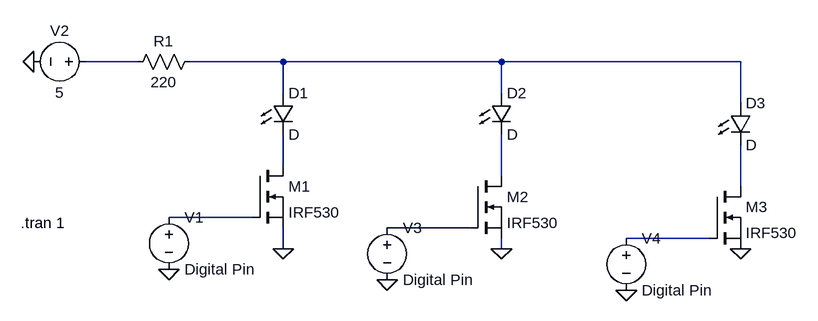
[diagram p0: schematic Sensor_test.asc]
Sensor_test.asc, the LTspice schematic file:
Version 4
SHEET 1 1172 680
WIRE 16 64 -64 64
WIRE 240 64 96 64
WIRE 576 64 240 64
WIRE 944 64 576 64
WIRE 240 112 240 64
WIRE 576 112 576 64
WIRE 944 128 944 64
WIRE 240 224 240 176
WIRE 576 240 576 176
WIRE 944 256 944 192
WIRE 192 304 64 304
WIRE 528 320 400 320
WIRE 896 336 768 336
WIRE 240 352 240 320
WIRE 576 352 576 336
FLAG -144 64 0
FLAG 64 384 0
FLAG 400 400 0
FLAG 576 352 0
FLAG 768 416 0
FLAG 944 352 0
FLAG 240 352 0
SYMBOL nmos 192 224 R0
SYMATTR InstName M1
SYMATTR Value IRF530
SYMBOL res 112 48 R90
WINDOW 0 0 56 VBottom 2
WINDOW 3 32 56 VTop 2
SYMATTR InstName R1
SYMATTR Value 220
SYMBOL voltage 64 288 R0
WINDOW 123 0 0 Left 0
WINDOW 39 0 0 Left 0
SYMATTR InstName V1
SYMATTR Value Digital Pin
SYMBOL voltage -48 64 R90
WINDOW 0 -32 56 VBottom 2
WINDOW 3 32 56 VTop 2
WINDOW 123 0 0 Left 0
WINDOW 39 0 0 Left 0
SYMATTR InstName V2
SYMATTR Value 5
SYMBOL nmos 528 240 R0
SYMATTR InstName M2
SYMATTR Value IRF530
SYMBOL voltage 400 304 R0
WINDOW 123 0 0 Left 0
WINDOW 39 0 0 Left 0
SYMATTR InstName V3
SYMATTR Value Digital Pin
SYMBOL nmos 896 256 R0
SYMATTR InstName M3
SYMATTR Value IRF530
SYMBOL voltage 768 320 R0
WINDOW 123 0 0 Left 0
WINDOW 39 0 0 Left 0
SYMATTR InstName V4
SYMATTR Value Digital Pin
SYMBOL LED 224 112 R0
SYMATTR InstName D1
SYMBOL LED 560 112 R0
SYMATTR InstName D2
SYMBOL LED 928 128 R0
SYMATTR InstName D3
TEXT -164 312 Left 2 !.tran 1

The netlist it stands for:
* Sensor_test.asc
M1 N003 N006 0 0 IRF530
R1 N002 N001 220
V1 N006 0 Digital Pin
V2 N001 0 5
M2 N004 N007 0 0 IRF530
V3 N007 0 Digital Pin
M3 N005 N008 0 0 IRF530
V4 N008 0 Digital Pin
D1 N002 N003 D
D2 N002 N004 D
D3 N002 N005 D
.model D D
.lib standard.dio
.model NMOS NMOS
.model PMOS PMOS
.lib standard.mos
.tran 1
.backanno
.end